# EAGLE design anten (EAGLE 6.5.0)
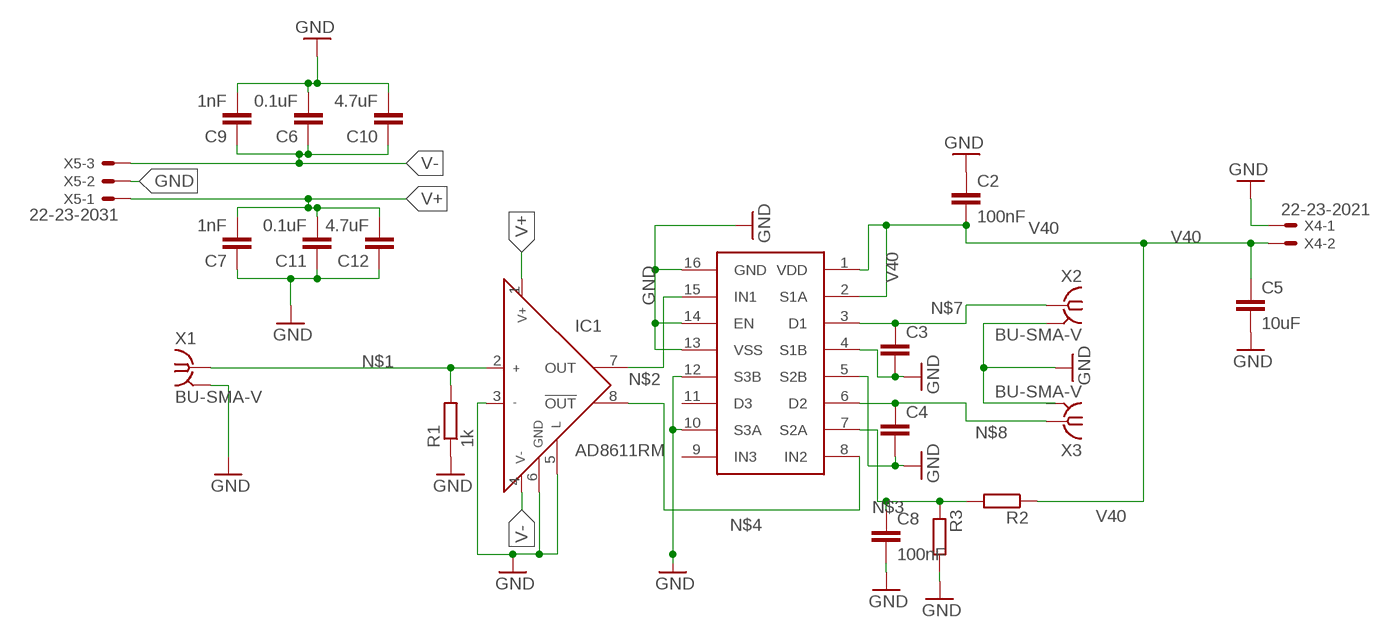
[diagram p0: schematic, sheet 1]

## Parts
C2  100nF  C-EUC0402  [C0402]
C3  C-EUC0402  [C0402]
C4  C-EUC0402  [C0402]
C5  10uF  C-EUC1206  [C1206]
C6  0.1uF  C-EUC0805  [C0805]
C7  1nF  C-EUC0805  [C0805]
C8  100nF  C-EUC0402  [C0402]
C9  1nF  C-EUC0805  [C0805]
C10  4.7uF  C-EUC0805  [C0805]
C11  0.1uF  C-EUC0805  [C0805]
C12  4.7uF  C-EUC0805  [C0805]
IC1  AD8611RM  [MSOP08]
R1  1k  R-EU_R0402  [R0402]
R2  R-EU_R0402  [R0402]
R3  R-EU_R0402  [R0402]
U$1  ADG5433  [TSSOP16]
X1  BU-SMA-V  [BU-SMA-V]
X2  BU-SMA-V  [BU-SMA-V]
X3  BU-SMA-V  [BU-SMA-V]
X4  22-23-2021  [22-23-2021]
X5  22-23-2031  [22-23-2031]

## Nets
GND: C2.1 C3.2 C4.2 C5.2 C6.2 C7.1 C8.2 C9.2 C10.2 C11.1 C12.1 IC1.3(IN-) IC1.5(L) IC1.6(GND) R1.1 R3.2 U$1.4(S1B) U$1.5(S2B) U$1.10(S3A) U$1.12(S3B) U$1.13(VSS) U$1.14(EN) U$1.16(GND) X1.2 X1.3 X1.4 X1.5 X2.2 X2.3 X2.4 X2.5 X4.1 X5.2
N$1: IC1.2(IN+) R1.2 X1.1
N$2: IC1.7(OUT) U$1.15(IN1)
N$3: C8.1 R2.2 R3.1 U$1.7(S2A)
N$4: IC1.8(!OUT) U$1.8(IN2)
N$7: C3.1 U$1.3(D1) X2.1
N$8: C4.1 U$1.6(D2) X3.1
V40: C2.2 C5.1 R2.1 U$1.1(VDD) U$1.2(S1A) X4.2
V+: C7.2 C11.2 C12.2 IC1.1(V+) X5.1
V-: C6.1 C9.1 C10.1 IC1.4(V-) X5.3
Unconnected: U$1.9(IN3) U$1.11(D3) X3.2 X3.3 X3.4 X3.5

## Library data of the parts
C2-C12 = resistor:C-EU: CAPACITOR, European symbol
IC1 = analog-devices:AD8611: Ultrafast 4 ns Single Supply Comparators Source: http://www.analog.com/UploadedFiles/Data_Sheets/703465986AD8611_2_0.pdf Upgrade for LT1394 and LT1016 Designs; MPN: AD8611ARMZ-R2; OC_FARNELL: 1464995; OC_NEWARK: 19M8930
R1-R3 = resistor:R-EU_: RESISTOR, European symbol
U$1 = ADG5433:ADG5433
X1-X3 = con-coax:BU-SMA-V: FEMALE SMA CONNECTOR Radiall distributor RS 112-3794; OC_FARNELL: unknown; OC_NEWARK: unknown
X4 = con-molex:22-23-2021: .100" (2.54mm) Center Header - 2 Pin; MF: MOLEX; MPN: 22-23-2021; OC_FARNELL: 1462926; OC_NEWARK: 25C3832
X5 = con-molex:22-23-2031: .100" (2.54mm) Center Header - 3 Pin; MF: MOLEX; MPN: 22-23-2031; OC_FARNELL: 1462950; OC_NEWARK: 30C0862

## Board
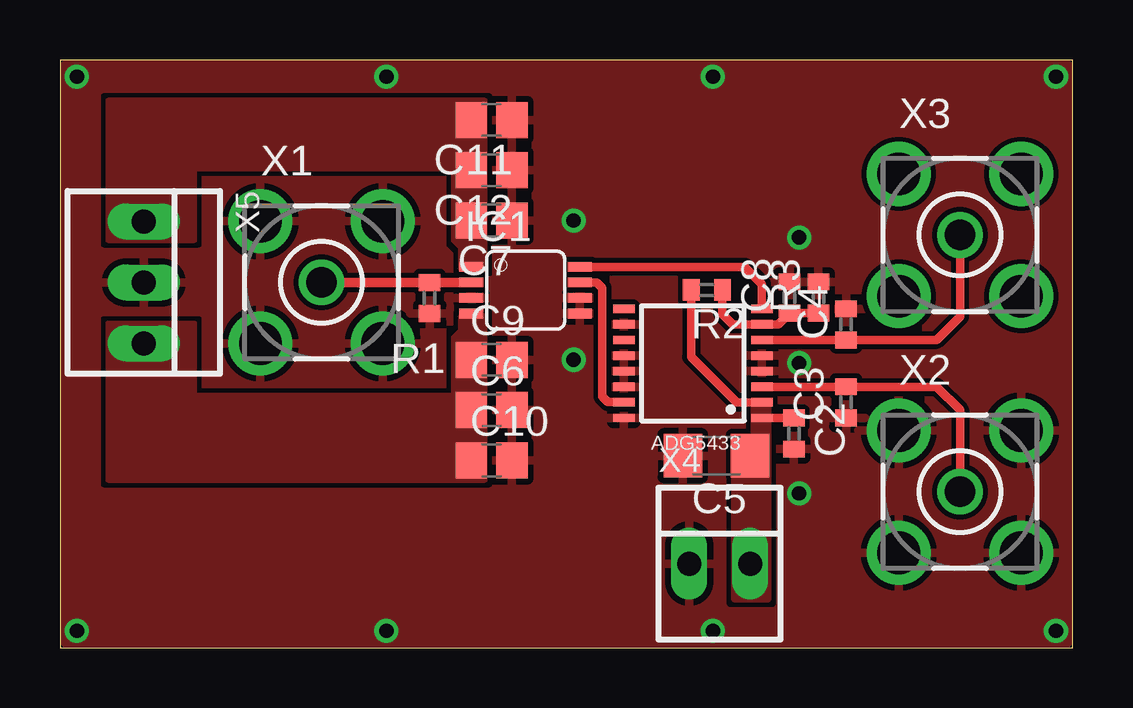
[diagram p1: board, top side]
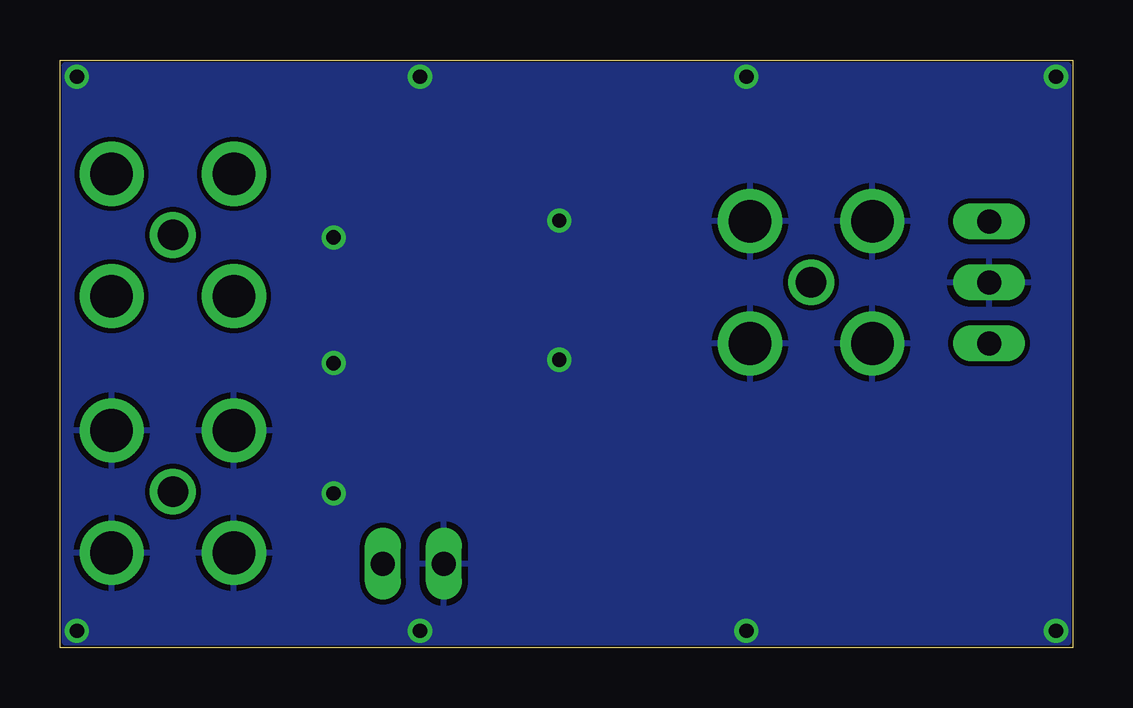
[diagram p2: board, bottom side, seen from below]

Size 42.2 x 24.5 mm. Coordinates in mm from the lower left corner, seen from the top.
Outline: 0,0 42.2,0 42.2,24.5 0,24.5 0,0
Copper layers (1*16): Top 0.035mm / dielectric 1.5mm / Bottom 0.035mm
Design rules "default *": minimum track width 10mil, minimum drill 20mil, track to track 8mil, track to pad 8mil, pad to pad 8mil, via to via 8mil, smd to smd 8mil, copper to edge 0mil, drill to drill 8mil, minimum pad ring 10mil, minimum via ring 8mil, stop-mask expansion 4mil, vias tented up to drill 0mil, thermal gap 10mil

### Footprints (pad centres in the part's own frame; a part is rotated, then mirrored left to right if it is on the bottom)
C0402 = smd 0.7 x 0.9: 1 -0.65,0; 2 0.65,0
C1206 = smd 1.6 x 1.8: 1 -1.4,0; 2 1.4,0
C0805 = smd 1.3 x 1.5: 1 -0.85,0; 2 0.85,0
MSOP08 = smd 0.4 x 1: 1 -0.976,-2.263; 2 -0.326,-2.263; 3 0.324,-2.263; 4 0.974,-2.263; 5 0.974,2.262; 6 0.324,2.262; 7 -0.326,2.262; 8 -0.976,2.262
R0402 = smd 0.7 x 0.9: 1 -0.65,0; 2 0.65,0
TSSOP16 = smd 0.9 x 0.35: 1 -2.875,2.275; 2 -2.875,1.625; 3 -2.875,0.975; 4 -2.875,0.325; 5 -2.875,-0.325; 6 -2.875,-0.975; 7 -2.875,-1.625; 8 -2.875,-2.275; 9 2.875,-2.275; 10 2.875,-1.625; 11 2.875,-0.975; 12 2.875,-0.325; 13 2.875,0.325; 14 2.875,0.975; 15 2.875,1.625; 16 2.875,2.275
BU-SMA-V = drill 1.27: 1 0,0 | drill 1.778: 2 -2.55,2.55; 3 2.55,2.55; 4 2.55,-2.55; 5 -2.55,-2.55
22-23-2021 = drill 1 long: 1 -1.27,0; 2 1.27,0
22-23-2031 = drill 1 long: 1 -2.54,0; 2 0,0; 3 2.54,0

### Placement (x,y rotation side)
C2  30.58,8.93 90 top
C3  32.75,10.22 270 top
C4  32.75,13.47 90 top
C5  27.35,8 180 top
C6  17.98,9.9 0 top
C7  17.98,17.8 180 top
C8  30.4,14.6 90 top
C9  17.98,12 0 top
C10  17.98,7.8 0 top
C11  17.98,22 180 top
C12  17.98,19.9 180 top
IC1  19.4,14.9 270 top
R1  15.4,14.57 90 top
R2  26.95,14.91 0 top
R3  31.6,14.6 90 top
U$1  26.37,11.85 180 top
X1  10.9,15.22 0 top
X2  37.5,6.5 0 top
X3  37.5,17.2 0 top
X4  27.48,3.5 0 top
X5  3.49,15.22 270 top

### Tracks (layer width: path | path; a pad name or v marks a point on that pad's centre or on a via)
GND  (via drill 0.6)
  other vias: 0.7,23.8 0.7,0.7 13.6,23.8 13.6,0.7 21.4,12 27.2,23.8 30.8,17.1 30.8,6.42 27.2,0.7 41.5,0.7 41.5,23.8 21.4,17.8 30.8,11.86
  pour Top (rank 2): 0.2,0.2 0.2,24.3 42,24.3 42,0.2
  pour Bottom: 0.2,24.3 0.2,0.2 42,0.2 42,24.3
N$1
  Top 0.4: IC1.2 R1.2 X1.1
N$2
  Top 0.35: IC1.7 22.37,15.23 22.6,15 22.6,10.46 22.83,10.23 U$1.15
N$3
  Top 0.35: R3.1 C8.1 29.93,13.47 U$1.7 28.02,13.47 27.6,13.9 R2.2
N$4
  Top 0.35: U$1.8 29.25,15.16 28.54,15.87 IC1.8
N$7
  Top 0.35: U$1.3 C3.1 36.52,10.88 37.5,9.9 X2.1
N$8
  Top 0.35: U$1.6 C4.1 36.52,12.82 37.5,13.8 X3.1
V40
  Top 0.35: R2.1 26.3,12.12 28.2,10.22 U$1.2 | U$1.1 C2.2
  pour Top (no thermals): 29.5,2 28.1,2 28.1,8 28.2,8 28.9,8.7 28.9,10.3 29.5,10.3
V+
  Top 0.4: C7.2
  pour Top (no thermals): 17.7,22.8 2,22.8 2,17 5.6,17 5.6,20 16.4,20 16.4,17 16.7,16.7 16.7,15.8 17.7,15.8
V-
  pour Top (no thermals): 2,13.5 2,7 17.7,7 17.7,13.8 16.7,13.8 16.7,13.2 16.4,12.9 16.4,10.5 5.6,10.5 5.6,13.5